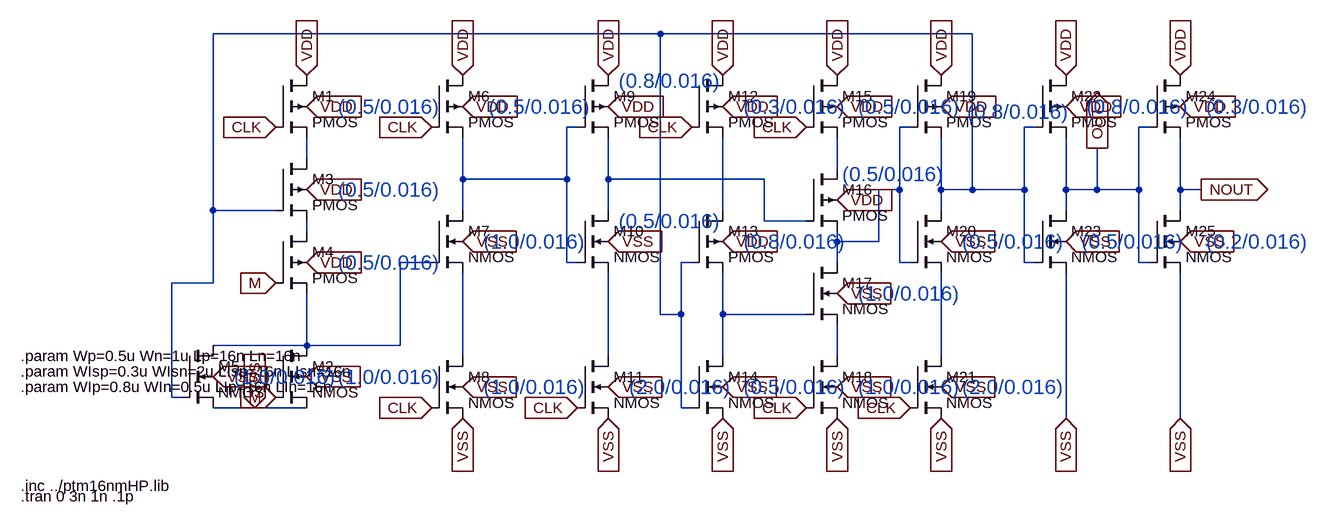
[diagram p0: schematic TSPC_33GHz_2by3PSC.asc]
TSPC_33GHz_2by3PSC.asc, the LTspice schematic file:
Version 4
SHEET 1 1996 904
WIRE 752 -16 64 -16
WIRE 1232 -16 752 -16
WIRE 624 128 608 128
WIRE 1136 128 1120 128
WIRE 1328 128 1312 128
WIRE 1504 128 1488 128
WIRE 208 176 208 144
WIRE 1024 192 1024 144
WIRE 448 208 448 144
WIRE 608 208 608 128
WIRE 608 208 448 208
WIRE 672 208 672 144
WIRE 912 208 672 208
WIRE 1120 224 1120 128
WIRE 1120 224 1088 224
WIRE 1184 224 1184 144
WIRE 1232 224 1232 -16
WIRE 1232 224 1184 224
WIRE 1312 224 1312 128
WIRE 1312 224 1232 224
WIRE 1376 224 1376 144
WIRE 1424 224 1424 160
WIRE 1424 224 1376 224
WIRE 1488 224 1488 128
WIRE 1488 224 1424 224
WIRE 1552 224 1552 144
WIRE 1584 224 1552 224
WIRE 64 256 64 -16
WIRE 160 256 64 256
WIRE 448 256 448 208
WIRE 672 256 672 208
WIRE 848 256 848 144
WIRE 1184 256 1184 224
WIRE 1376 256 1376 224
WIRE 1552 256 1552 224
WIRE 912 272 912 208
WIRE 976 272 912 272
WIRE 208 288 208 272
WIRE 1024 304 1024 288
WIRE 1088 304 1088 224
WIRE 1088 304 1024 304
WIRE 400 336 352 336
WIRE 608 336 608 208
WIRE 624 336 608 336
WIRE 800 336 784 336
WIRE 1024 336 1024 304
WIRE 1120 336 1120 224
WIRE 1136 336 1120 336
WIRE 1312 336 1312 224
WIRE 1328 336 1312 336
WIRE 1488 336 1488 224
WIRE 1504 336 1488 336
WIRE 64 368 64 256
WIRE 64 368 0 368
WIRE 752 416 752 -16
WIRE 784 416 784 336
WIRE 784 416 752 416
WIRE 848 416 848 352
WIRE 976 416 848 416
WIRE 208 464 208 384
WIRE 208 464 64 464
WIRE 352 464 352 336
WIRE 352 464 208 464
WIRE 448 480 448 352
WIRE 672 480 672 352
WIRE 848 480 848 416
WIRE 1024 480 1024 432
WIRE 1184 480 1184 352
WIRE 0 544 0 368
WIRE 16 544 0 544
WIRE 128 560 64 560
WIRE 208 560 128 560
WIRE 784 560 784 416
WIRE 800 560 784 560
WIRE 1376 576 1376 352
WIRE 1552 576 1552 352
FLAG 208 96 VDD
IOPIN 208 96 In
FLAG 208 512 VSS
IOPIN 208 512 In
FLAG 208 48 VDD
IOPIN 208 48 In
FLAG 208 224 VDD
IOPIN 208 224 In
FLAG 208 336 VDD
IOPIN 208 336 In
FLAG 64 512 VSS
IOPIN 64 512 In
FLAG 448 96 VDD
IOPIN 448 96 In
FLAG 448 48 VDD
IOPIN 448 48 In
FLAG 448 304 VSS
IOPIN 448 304 In
FLAG 448 528 VSS
IOPIN 448 528 In
FLAG 672 96 VDD
IOPIN 672 96 In
FLAG 672 48 VDD
IOPIN 672 48 In
FLAG 672 304 VSS
IOPIN 672 304 In
FLAG 672 528 VSS
IOPIN 672 528 In
FLAG 848 96 VDD
IOPIN 848 96 In
FLAG 848 48 VDD
IOPIN 848 48 In
FLAG 848 304 VDD
IOPIN 848 304 In
FLAG 848 528 VSS
IOPIN 848 528 In
FLAG 1024 96 VDD
IOPIN 1024 96 In
FLAG 1024 48 VDD
IOPIN 1024 48 In
FLAG 1024 240 VDD
IOPIN 1024 240 In
FLAG 1024 384 VSS
IOPIN 1024 384 In
FLAG 1024 528 VSS
IOPIN 1024 528 In
FLAG 1184 96 VDD
IOPIN 1184 96 In
FLAG 1184 48 VDD
IOPIN 1184 48 In
FLAG 1184 304 VSS
IOPIN 1184 304 In
FLAG 1184 528 VSS
IOPIN 1184 528 In
FLAG 128 560 VSS
IOPIN 128 560 In
FLAG 448 576 VSS
IOPIN 448 576 In
FLAG 672 576 VSS
IOPIN 672 576 In
FLAG 848 576 VSS
IOPIN 848 576 In
FLAG 1024 576 VSS
IOPIN 1024 576 In
FLAG 1184 576 VSS
IOPIN 1184 576 In
FLAG 624 560 CLK
IOPIN 624 560 In
FLAG 800 128 CLK
IOPIN 800 128 In
FLAG 976 128 CLK
IOPIN 976 128 In
FLAG 976 560 CLK
IOPIN 976 560 In
FLAG 1136 560 CLK
IOPIN 1136 560 In
FLAG 400 128 CLK
IOPIN 400 128 In
FLAG 400 560 CLK
IOPIN 400 560 In
FLAG 160 128 CLK
IOPIN 160 128 In
FLAG 160 368 M
IOPIN 160 368 In
FLAG 160 544 M
IOPIN 160 544 In
FLAG 1376 96 VDD
IOPIN 1376 96 In
FLAG 1376 48 VDD
IOPIN 1376 48 In
FLAG 1376 304 VSS
IOPIN 1376 304 In
FLAG 1376 576 VSS
IOPIN 1376 576 In
FLAG 1424 160 OUT
IOPIN 1424 160 Out
FLAG 1552 96 VDD
IOPIN 1552 96 In
FLAG 1552 304 VSS
IOPIN 1552 304 In
FLAG 1584 224 NOUT
IOPIN 1584 224 Out
FLAG 1552 576 VSS
IOPIN 1552 576 In
FLAG 1552 48 VDD
IOPIN 1552 48 In
SYMBOL pmos4 160 48 R0
SYMATTR InstName M1
SYMATTR Value2 l={Lp} w={Wp}
SYMBOL nmos4 160 464 R0
SYMATTR InstName M2
SYMATTR Value2 l={Ln} w={Wn}
SYMBOL pmos4 160 176 R0
SYMATTR InstName M3
SYMATTR Value2 l={Lp} w={Wp}
SYMBOL pmos4 160 288 R0
SYMATTR InstName M4
SYMATTR Value2 l={Lp} w={Wp}
SYMBOL nmos4 16 464 R0
SYMATTR InstName M5
SYMATTR Value2 l={Ln} w={Wn}
SYMBOL pmos4 400 48 R0
SYMATTR InstName M6
SYMATTR Value2 l={Lp} w={Wp}
SYMBOL nmos4 400 256 R0
SYMATTR InstName M7
SYMATTR Value2 l={Ln} w={Wn}
SYMBOL nmos4 400 480 R0
SYMATTR InstName M8
SYMATTR Value2 l={Ln} w={Wn}
SYMBOL pmos4 624 48 R0
SYMATTR InstName M9
SYMATTR Value2 l={LIp} w={WIp}
SYMBOL nmos4 624 256 R0
SYMATTR InstName M10
SYMATTR Value2 l={LIn} w={WIn}
SYMBOL nmos4 624 480 R0
SYMATTR InstName M11
SYMATTR Value2 l={LIsn} w={WIsn}
SYMBOL pmos4 800 48 R0
SYMATTR InstName M12
SYMATTR Value2 l={LIsp} w={WIsp}
SYMBOL pmos4 800 256 R0
SYMATTR InstName M13
SYMATTR Value2 l={LIp} w={WIp}
SYMBOL nmos4 800 480 R0
SYMATTR InstName M14
SYMATTR Value2 l={LIn} w={WIn}
SYMBOL pmos4 976 48 R0
SYMATTR InstName M15
SYMATTR Value2 l={Lp} w={Wp}
SYMBOL pmos4 976 192 R0
SYMATTR InstName M16
SYMATTR Value2 l={Lp} w={Wp}
SYMBOL nmos4 976 336 R0
SYMATTR InstName M17
SYMATTR Value2 l={Ln} w={Wn}
SYMBOL nmos4 976 480 R0
SYMATTR InstName M18
SYMATTR Value2 l={Ln} w={Wn}
SYMBOL pmos4 1136 48 R0
SYMATTR InstName M19
SYMATTR Value2 l={LIp} w={WIp}
SYMBOL nmos4 1136 256 R0
SYMATTR InstName M20
SYMATTR Value2 l={LIn} w={WIn}
SYMBOL nmos4 1136 480 R0
SYMATTR InstName M21
SYMATTR Value2 l={LIsn} w={WIsn}
SYMBOL pmos4 1328 48 R0
SYMATTR InstName M22
SYMATTR Value2 l={LIp} w={WIp}
SYMBOL nmos4 1328 256 R0
SYMATTR InstName M23
SYMATTR Value2 l={LIn} w={WIn}
SYMBOL pmos4 1504 48 R0
SYMATTR InstName M24
SYMATTR Value2 l={LIp} w=0.3u
SYMBOL nmos4 1504 256 R0
SYMATTR InstName M25
SYMATTR Value2 l={LIn} w=0.2u
TEXT -232 680 Left 2 !.inc ../ptm16nmHP.lib
TEXT -232 480 Left 2 !.param Wp=0.5u Wn=1u Lp=16n Ln=16n
TEXT -232 504 Left 2 !.param WIsp=0.3u WIsn=2u LIsp=16n LIsn=16n
TEXT -232 528 Left 2 !.param WIp=0.8u WIn=0.5u LIp=16n LIn=16n
TEXT -232 696 Left 2 !.tran 0 3n 1n .1p
TEXT 256 96 Left 3 ;(0.5/0.016)
TEXT 256 224 Left 3 ;(0.5/0.016)
TEXT 256 336 Left 3 ;(0.5/0.016)
TEXT 256 512 Left 3 ;(1.0/0.016)
TEXT 96 512 Left 3 ;(1.0/0.016)
TEXT 488 96 Left 3 ;(0.5/0.016)
TEXT 688 56 Left 3 ;(0.8/0.016)
TEXT 688 272 Left 3 ;(0.5/0.016)
TEXT 704 528 Left 3 ;(2.0/0.016)
TEXT 880 528 Left 3 ;(0.5/0.016)
TEXT 880 304 Left 3 ;(0.8/0.016)
TEXT 880 96 Left 3 ;(0.3/0.016)
TEXT 1056 96 Left 3 ;(0.5/0.016)
TEXT 1032 200 Left 3 ;(0.5/0.016)
TEXT 1056 528 Left 3 ;(1.0/0.016)
TEXT 1216 528 Left 3 ;(2.0/0.016)
TEXT 1216 304 Left 3 ;(0.5/0.016)
TEXT 1224 104 Left 3 ;(0.8/0.016)
TEXT 1400 304 Left 3 ;(0.5/0.016)
TEXT 1592 304 Left 3 ;(0.2/0.016)
TEXT 1592 96 Left 3 ;(0.3/0.016)
TEXT 480 528 Left 3 ;(1.0/0.016)
TEXT 480 304 Left 3 ;(1.0/0.016)
TEXT 1056 384 Left 3 ;(1.0/0.016)
TEXT 1408 96 Left 3 ;(0.8/0.016)

The netlist it stands for:
* TSPC_33GHz_2by3PSC.asc
M1 VDD CLK N004 VDD PMOS l={Lp} w={Wp}
M2 N009 M VSS VSS NMOS l={Ln} w={Wn}
M3 N004 N001 N008 VDD PMOS l={Lp} w={Wp}
M4 N008 M N009 VDD PMOS l={Lp} w={Wp}
M5 N009 N001 VSS VSS NMOS l={Ln} w={Wn}
M6 VDD CLK N002 VDD PMOS l={Lp} w={Wp}
M7 N002 N009 N011 VSS NMOS l={Ln} w={Wn}
M8 N011 CLK VSS VSS NMOS l={Ln} w={Wn}
M9 VDD N002 N006 VDD PMOS l={LIp} w={WIp}
M10 N006 N002 N012 VSS NMOS l={LIn} w={WIn}
M11 N012 CLK VSS VSS NMOS l={LIsn} w={WIsn}
M12 VDD CLK N007 VDD PMOS l={LIsp} w={WIsp}
M13 N007 N001 N010 VDD PMOS l={LIp} w={WIp}
M14 N010 N001 VSS VSS NMOS l={LIn} w={WIn}
M15 VDD CLK N005 VDD PMOS l={Lp} w={Wp}
M16 N005 N006 N003 VDD PMOS l={Lp} w={Wp}
M17 N003 N010 N013 VSS NMOS l={Ln} w={Wn}
M18 N013 CLK VSS VSS NMOS l={Ln} w={Wn}
M19 VDD N003 N001 VDD PMOS l={LIp} w={WIp}
M20 N001 N003 N014 VSS NMOS l={LIn} w={WIn}
M21 N014 CLK VSS VSS NMOS l={LIsn} w={WIsn}
M22 VDD N001 OUT VDD PMOS l={LIp} w={WIp}
M23 OUT N001 VSS VSS NMOS l={LIn} w={WIn}
M24 VDD OUT NOUT VDD PMOS l={LIp} w=0.3u
M25 NOUT OUT VSS VSS NMOS l={LIn} w=0.2u
.model NMOS NMOS
.model PMOS PMOS
.lib standard.mos
.inc ../ptm16nmHP.lib
.param Wp=0.5u Wn=1u Lp=16n Ln=16n
.param WIsp=0.3u WIsn=2u LIsp=16n LIsn=16n
.param WIp=0.8u WIn=0.5u LIp=16n LIn=16n
.tran 0 3n 1n .1p
* (0.5/0.016)
* (0.5/0.016)
* (0.5/0.016)
* (1.0/0.016)
* (1.0/0.016)
* (0.5/0.016)
* (0.8/0.016)
* (0.5/0.016)
* (2.0/0.016)
* (0.5/0.016)
* (0.8/0.016)
* (0.3/0.016)
* (0.5/0.016)
* (0.5/0.016)
* (1.0/0.016)
* (2.0/0.016)
* (0.5/0.016)
* (0.8/0.016)
* (0.5/0.016)
* (0.2/0.016)
* (0.3/0.016)
* (1.0/0.016)
* (1.0/0.016)
* (1.0/0.016)
* (0.8/0.016)
.backanno
.end